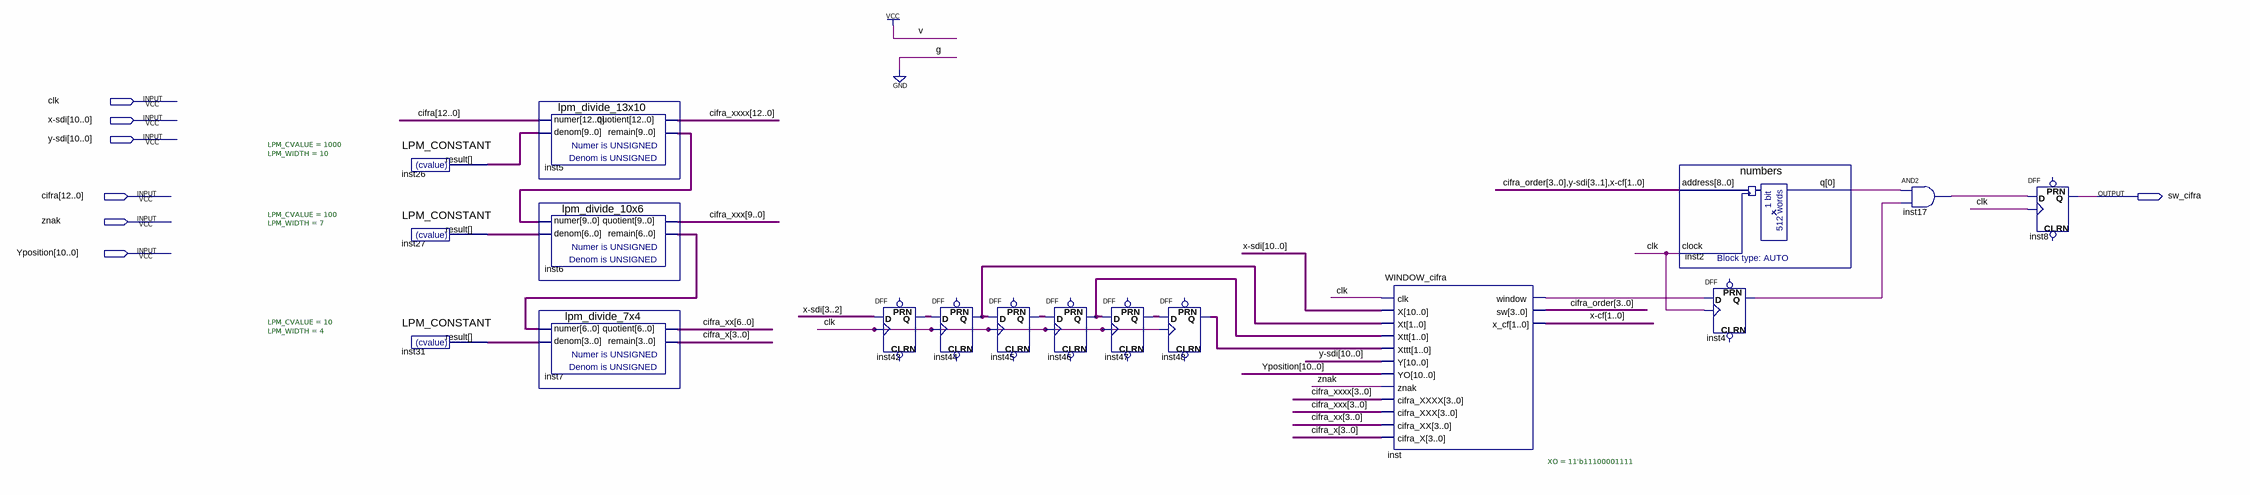
[diagram p0: schematic sheet]
// Quartus schematic Draw_numbers.bdf as structural Verilog: 17 symbols, 7 pins
module Draw_numbers (
  input  clk,
  input  [10:0] \x-sdi ,
  input  [10:0] \y-sdi ,
  input  [12:0] cifra,
  input  znak,
  input  [10:0] Yposition,
  output sw_cifra
);

  wire inst2_q, inst4_q, inst17_out, inst_window;
  wire [1:0] inst42_q, inst44_q, inst45_q, inst46_q, inst47_q, inst48_q, \x-cf ;
  wire [3:0] cifra_order, cifra_x, inst31_result;
  wire [6:0] cifra_xx, inst6_remain, inst27_result;
  wire [9:0] cifra_xxx, inst5_remain, inst26_result;
  wire [12:0] cifra_xxxx;

  LPM_CONSTANT #(.LPM_CVALUE(1000), .LPM_WIDTH(10)) inst26 (.result(inst26_result));
  LPM_CONSTANT #(.LPM_CVALUE(100), .LPM_WIDTH(7)) inst27 (.result(inst27_result));
  LPM_CONSTANT #(.LPM_CVALUE(10), .LPM_WIDTH(4)) inst31 (.result(inst31_result));
  lpm_divide_13x10 inst5 (.numer(cifra), .denom(inst26_result), .quotient(cifra_xxxx), .remain(inst5_remain));
  lpm_divide_10x6 inst6 (.numer(inst5_remain), .denom(inst27_result), .quotient(cifra_xxx), .remain(inst6_remain));
  lpm_divide_7x4 inst7 (.numer(inst6_remain), .denom(inst31_result), .quotient(cifra_xx), .remain(cifra_x));
  DFF inst42[1:0] (.CLK(clk), .D(\x-sdi [3:2]), .Q(inst42_q));  // open: CLRN, PRN
  DFF inst44[1:0] (.CLK(clk), .D(inst42_q), .Q(inst44_q));  // open: CLRN, PRN
  DFF inst45[1:0] (.CLK(clk), .D(inst44_q), .Q(inst45_q));  // open: CLRN, PRN
  DFF inst46[1:0] (.CLK(clk), .D(inst45_q), .Q(inst46_q));  // open: CLRN, PRN
  DFF inst47[1:0] (.CLK(clk), .D(inst46_q), .Q(inst47_q));  // open: CLRN, PRN
  DFF inst48[1:0] (.CLK(clk), .D(inst47_q), .Q(inst48_q));  // open: CLRN, PRN
  WINDOW_cifra #(.XO(11'b11100001111)) inst (
    .clk(clk), .X(\x-sdi ), .Xt(inst44_q), .Xtt(inst46_q), .Xttt(inst48_q), .Y(\y-sdi ), .YO(Yposition),
    .znak(znak), .cifra_XXXX(cifra_xxxx[3:0]), .cifra_XXX(cifra_xxx[3:0]), .cifra_XX(cifra_xx[3:0]),
    .cifra_X(cifra_x), .window(inst_window), .sw(cifra_order), .x_cf(\x-cf ));
  numbers inst2 (.address({cifra_order, \y-sdi [3:1], \x-cf }), .clock(clk), .q(inst2_q));
  DFF inst4 (.CLK(clk), .D(inst_window), .Q(inst4_q));  // open: CLRN, PRN
  and inst17 (inst17_out, inst2_q, inst4_q);
  DFF inst8 (.CLK(clk), .D(inst17_out), .Q(sw_cifra));  // open: CLRN, PRN
endmodule
